# EAGLE design ad724pal (EAGLE 6.5.0)
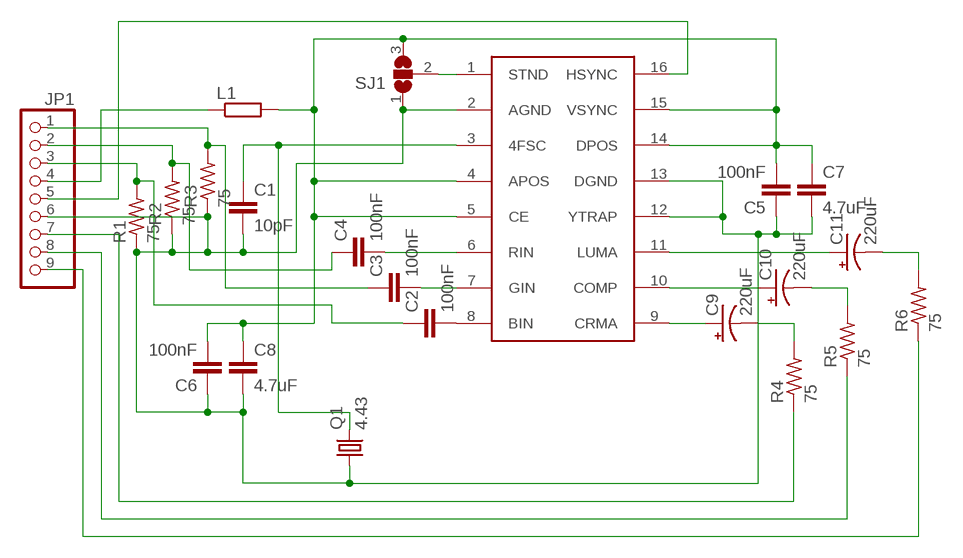
[diagram p0: schematic, sheet 1]

## Parts
C1  10pF  C-EUC0805  [C0805]
C2  100nF  C-EUC0603  [C0603]
C3  100nF  C-EUC0603  [C0603]
C4  100nF  C-EUC0603  [C0603]
C5  100nF  C-EUC0603  [C0603]
C6  100nF  C-EUC0603  [C0603]
C7  4.7uF  C-EUC0805  [C0805]
C8  4.7uF  C-EUC0805  [C0805]
C9  220uF  CPOL-USE2.5-6  [E2,5-6]
C10  220uF  CPOL-USE2.5-6  [E2,5-6]
C11  220uF  CPOL-USE2.5-6  [E2,5-6]
JP1  PINHD-1X9  [1X09]
L1  R-EU_R0805  [R0805]
Q1  4.43  CRYSTALHC49S  [HC49/S]
R1  75  R-US_R0805  [R0805]
R2  75  R-US_R0805  [R0805]
R3  75  R-US_R0805  [R0805]
R4  75  R-US_R0805  [R0805]
R5  75  R-US_R0805  [R0805]
R6  75  R-US_R0805  [R0805]
SJ1  SJ2W  [SJ_2]
U1  AD725  [SO16W]

## Nets
GND: C1.2 C5.1 C6.1 C7.2 C8.2 JP1.6 Q1.1 R1.1 R2.1 R3.1 SJ1.1 U1.2(AGND) U1.12(YTRAP) U1.13(DGND)
N$1: C4.1 JP1.2 R2.2
N$2: SJ1.2 U1.1(STND)
N$3: C5.2 C6.2 C7.1 C8.1 L1.2 SJ1.3 U1.4(APOS) U1.5(CE) U1.14(DPOS) U1.15(VSYNC)
N$4: C4.2 U1.6(RIN)
N$5: JP1.4 L1.1
N$6: JP1.5 U1.16(HSYNC)
N$7: C3.2 U1.7(GIN)
N$8: C2.2 U1.8(BIN)
N$10: C3.1 JP1.1 R3.2
N$14: C2.1 JP1.3 R1.2
N$18: C1.1 Q1.2 U1.3(4FSC)
N$23: C11.+ U1.11(LUMA)
N$24: C10.+ U1.10(COMP)
N$25: C9.+ U1.9(CRMA)
N$26: C11.- R6.2
N$27: C10.- R5.2
N$28: C9.- R4.2
N$29: JP1.7 R4.1
N$30: JP1.8 R5.1
N$31: JP1.9 R6.1

## Library data of the parts
C1-C8 = resistor:C-EU: CAPACITOR, European symbol
C9-C11 = rcl:CPOL-US: POLARIZED CAPACITOR, American symbol
JP1 = pinhead:PINHD-1X9: PIN HEADER
L1 = resistor:R-EU_: RESISTOR, European symbol
Q1 = crystal:CRYSTAL: CRYSTAL; OC_FARNELL: 1667008; OC_NEWARK: unknown
R1-R6 = resistor:R-US_: RESISTOR, American symbol
SJ1 = jumper:SJ2W: SMD solder JUMPER
U1 = ad725:AD725

## Board
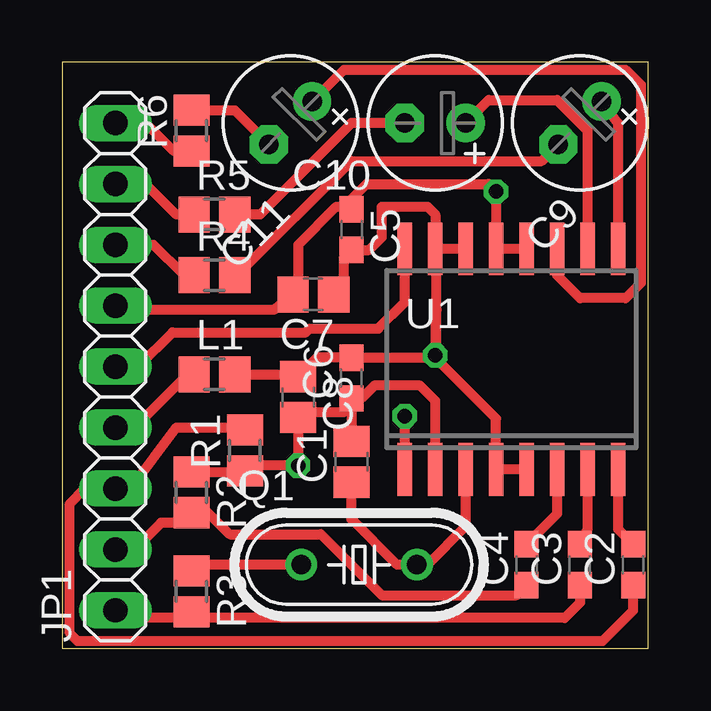
[diagram p1: board, top side]
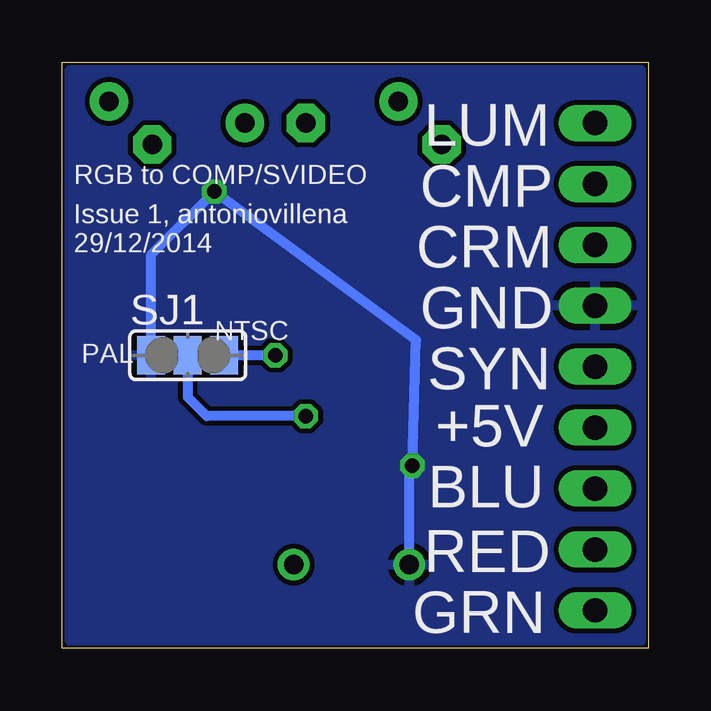
[diagram p2: board, bottom side, seen from below]

No outline drawn. Coordinates in mm, seen from the top.
Copper layers (1*16): Top 0.035mm / dielectric 1.5mm / Bottom 0.035mm
Design rules "default": minimum track width 10mil, minimum drill 24mil, track to track 8mil, track to pad 8mil, pad to pad 8mil, via to via 8mil, smd to smd 8mil, copper to edge 40mil, drill to drill 8mil, minimum pad ring 10mil, minimum via ring 8mil, stop-mask expansion 4mil, vias tented up to drill 0mil, thermal gap 10mil
Milling: 4 lines

### Footprints (pad centres in the part's own frame; a part is rotated, then mirrored left to right if it is on the bottom)
C0805 = smd 1.3 x 1.5: 1 -0.85,0; 2 0.85,0
C0603 = smd 1.1 x 1: 1 -0.85,0; 2 0.85,0
E2,5-6 = drill 0.813 pad 1.6: + -1.27,0 | drill 0.813 pad 1.6 octagon: - 1.27,0
1X09 = drill 1.016 long: 1 -10.16,0; 2 -7.62,0; 3 -5.08,0; 4 -2.54,0; 5 0,0; 6 2.54,0; 7 5.08,0; 8 7.62,0; 9 10.16,0
R0805 = smd 1.3 x 1.5: 1 -0.85,0; 2 0.85,0
HC49/S = drill 0.813: 1 -2.413,0; 2 2.413,0
SJ_2 = smd 1.168 x 1.6: 1 -1.524,0; 2 0,0; 3 1.524,0
SO16W = smd 0.6 x 2.2: 1 -4.445,-4.6; 2 -3.175,-4.6; 3 -1.905,-4.6; 4 -0.635,-4.6; 5 0.635,-4.6; 6 1.905,-4.6; 7 3.175,-4.6; 8 4.445,-4.6; 9 4.445,4.6; 10 3.175,4.6; 11 1.905,4.6; 12 0.635,4.6; 13 -0.635,4.6; 14 -1.905,4.6; 15 -3.175,4.6; 16 -4.445,4.6

### Placement (x,y rotation side)
C1  12.06,7.78 90 top
C2  23.81,3.49 90 top
C3  21.59,3.49 90 top
C4  19.37,3.49 90 top
C5  12.06,17.46 270 top
C6  12.06,11.27 90 top
C7  10.48,14.76 180 top
C8  9.84,10.48 270 top
C9  21.59,21.91 225 top
C10  15.56,21.91 180 top
C11  9.53,21.91 225 top
JP1  2.22,11.75 90 top
L1  6.35,11.43 0 top
Q1  12.38,3.49 0 top
R1  7.62,8.26 90 top
R2  5.4,6.51 270 top
R3  5.4,2.38 270 top
R4  6.35,15.56 0 top
R5  6.35,18.1 0 top
R6  5.4,21.59 90 top
SJ1  19.21,12.22 0 bottom
U1  18.73,12.06 0 top

### Tracks (layer width: path | path; a pad name or v marks a point on that pad's centre or on a via)
GND  (via drill 0.6)
  Top 0.406: U1.13 U1.12 | U1.13 18.1,17.78 | C7.2 9.21,14.92 | C7.2 9.84,15.14 9.84,16.83 11.43,18.41 11.96,18.41 C5.1 12.06,18.73 12.7,19.37 17.78,19.37 v18.1,19.05 U1.13 | JP1.6 2.54,14.13 8.83,14.13 C7.2 | Q1.1 5.5,3.49 R3.1 | C6.1 C1.2 | C6.1 12.06,10.16 11.75,9.84 10.06,9.84 C8.2 v9.84,7.62 7.62,7.62 R1.1 7.62,7.36 R2.1 | U1.2 15.56,10.32 14.92,10.95 13.02,10.95 12.54,10.48 12.12,10.48 C6.1
  Bottom 0.406: Q1.1 9.97,7.43 v9.84,7.62 9.68,12.86 v18.1,19.05 20.73,16.41 SJ1.1
  pour Bottom: 0.32,0.32 24.13,0.32 24.13,24.13 0.32,24.13
N$1
  Top 0.406: C4.1 18.95,2.22 13.34,2.22 10.79,4.76 6.99,4.76 5.93,5.82 R2.2 5.4,5.24 4.13,5.24 3.02,4.13 JP1.2
N$2  (via drill 0.6)
  Top 0.406: U1.1 v14.29,9.68
  Bottom 0.406: v14.29,9.68 18.41,9.68 19.21,10.48 SJ1.2
N$3  (via drill 0.6)
  Top 0.406: U1.5 U1.4 18.1,9.58 15.61,12.06 | U1.15 U1.14 | U1.15 15.56,18.1 15.24,18.41 13.34,18.41 13.34,17.14 12.8,16.61 C5.2 11.75,16.3 11.75,15.24 11.43,14.92 C7.1 | 9.63,11.11 C8.1 | C8.1 10.64,12.12 C6.2 15.56,12.12 15.61,12.06 | 15.61,12.06 15.61,14.13 | 15.61,14.13 15.61,16.61 U1.15 | L1.2 9.74,11.43 C8.1 | v15.56,12.22 15.61,14.13
  Bottom 0.406: v15.56,12.22 SJ1.3
N$4
  Top 0.406: U1.6 20.64,5.61 C4.2
N$5
  Top 0.406: L1.1 5.24,11.43 3.02,9.21 JP1.4
N$6
  Top 0.406: JP1.5 3.17,11.75 4.6,13.18 10.16,13.18 10.32,13.34 13.18,13.34 14.29,14.45 U1.16
N$7
  Top 0.406: U1.7 21.91,4.98 C3.2
N$8
  Top 0.406: U1.8 23.18,4.98 C2.2
N$10
  Top 0.406: C3.1 21.59,1.91 20.95,1.27 5.71,1.27 | R3.2 5.71,1.27 | 5.71,1.27 2.54,1.27 JP1.1
N$14
  Top 0.406: C2.1 23.81,1.59 22.54,0.32 0.64,0.32 0.32,0.64 0.32,6.03 0.95,6.67 JP1.3 | R1.2 7.2,9.21 4.76,9.21 2.86,6.67 JP1.3 | 2.54,6.67 JP1.3
N$18
  Top 0.406: U1.3 16.83,5.08 15.24,3.49 Q1.2 13.97,3.49 12.06,5.4 C1.1
N$23
  Top 0.406: U1.11 20.64,15.56 21.59,14.61 23.5,14.61 24.13,15.24 24.13,23.5 23.5,24.13 11.75,24.13 C11.+
N$24
  Top 0.406: C10.+ 17.78,22.86 20.64,22.86 21.91,21.59 U1.10
N$25
  Top 0.406: C9.+ 23.18,21.91 U1.9
N$26
  Top 0.406: R6.2 7.2,22.44 C11.-
N$27
  Top 0.406: R5.2 8.26,18.1 12.06,21.91 C10.-
N$28
  Top 0.406: C9.- 20,20.32 12.06,20.32 7.3,15.56 R4.2
N$29
  Top 0.406: R4.1 5.08,15.56 3.81,16.83 JP1.7
N$30
  Top 0.406: R5.1 4.76,18.1 3.49,19.37 JP1.8
N$31
  Top 0.406: R6.1 4.66,20.74 3.49,21.91 JP1.9

### Text on the board
bPlace: LUM | RGB to COMP/SVIDEO | CMP | Issue 1, antoniovillena / 29/12/2014 | CRM | GND | SYN | +5V | BLU | RED | GRN
bNames: NTSC | PAL